# Altium schematic sheet ZHSD-BOOT-STORAGE.SchDoc
size A3
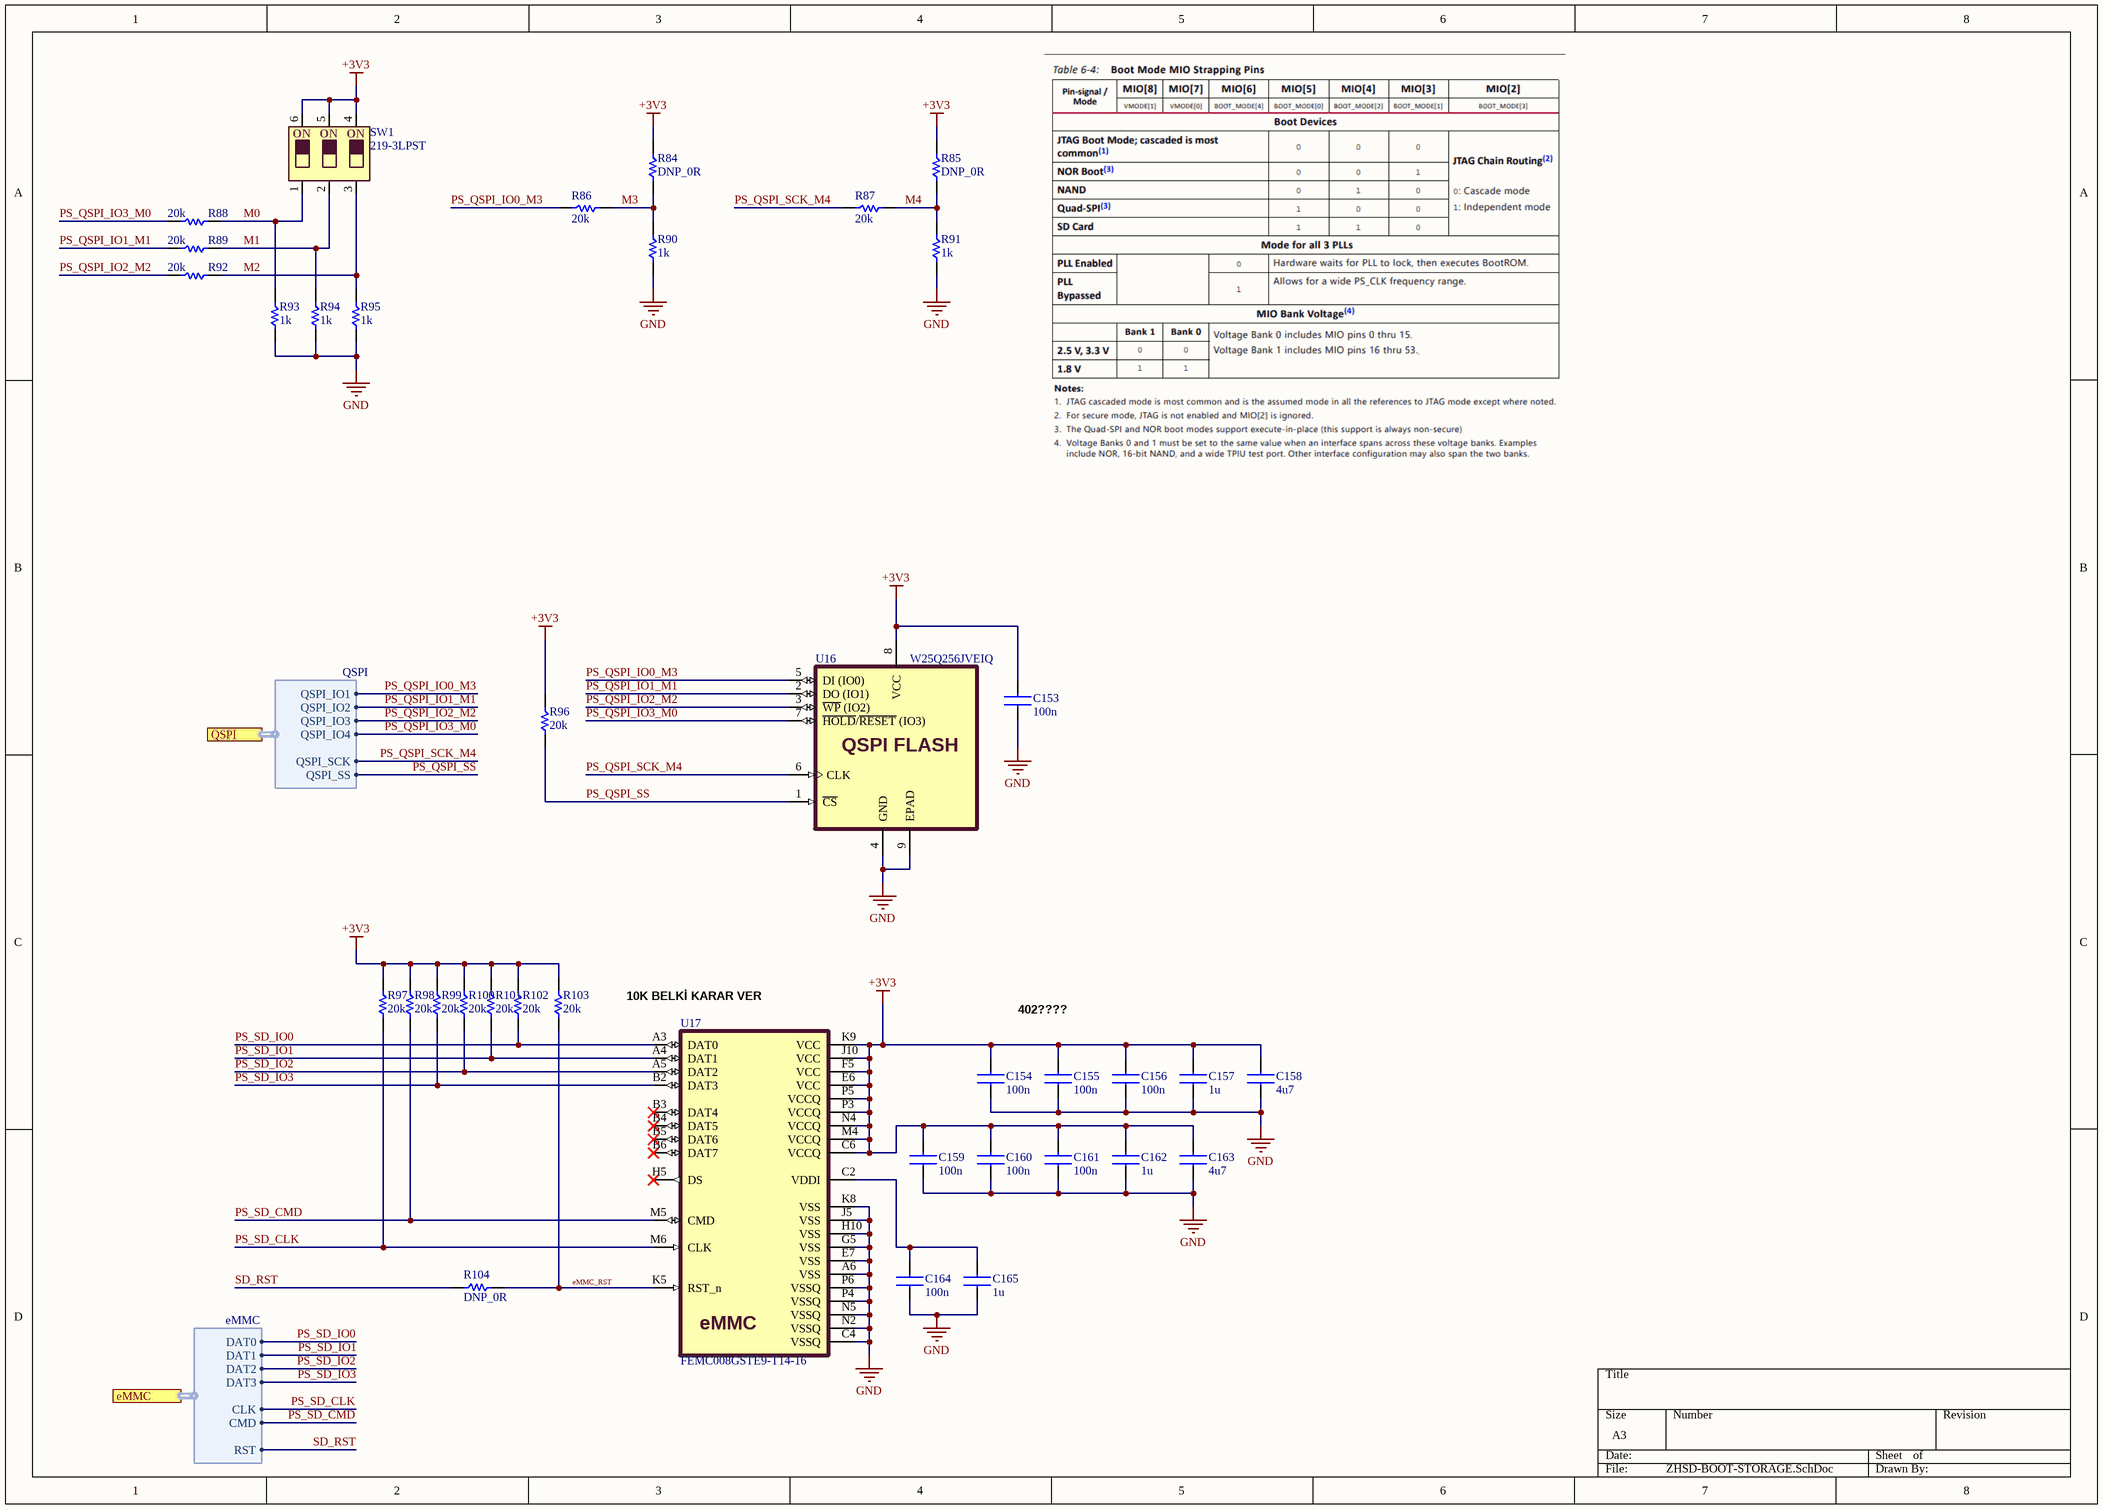
[diagram p0: ZHSD-BOOT-STORAGE.SchDoc]

## Parts
C153  100n  [0603CAPC1608X09N]
C154  100n  [0603CAPC1608X09N]
C155  100n  [0603CAPC1608X09N]
C156  100n  [0603CAPC1608X09N]
C157  1u  [0603CAPC1608X09N]
C158  4u7  [0603CAPC1608X09N]
C159  100n  [0603CAPC1608X09N]
C160  100n  [0603CAPC1608X09N]
C161  100n  [0603CAPC1608X09N]
C162  1u  [0603CAPC1608X09N]
C163  4u7  [0603CAPC1608X09N]
C164  100n  [0603CAPC1608X09N]
C165  1u  [0603CAPC1608X09N]
R84  DNP_0R  [0402RESC1005X04N]
R85  DNP_0R  [0402RESC1005X04N]
R86  20k  [0402RESC1005X04N]
R87  20k  [0402RESC1005X04N]
R88  20k  [0402RESC1005X04N]
R89  20k  [0402RESC1005X04N]
R90  1k  [0402RESC1005X04N]
R91  1k  [0402RESC1005X04N]
R92  20k  [0402RESC1005X04N]
R93  1k  [0402RESC1005X04N]
R94  1k  [0402RESC1005X04N]
R95  1k  [0402RESC1005X04N]
R96  20k  [0402RESC1005X04N]
R97  20k  [0402RESC1005X04N]
R98  20k  [0402RESC1005X04N]
R99  20k  [0402RESC1005X04N]
R100  20k  [0402RESC1005X04N]
R101  20k  [0402RESC1005X04N]
R102  20k  [0402RESC1005X04N]
R103  20k  [0402RESC1005X04N]
R104  DNP_0R  [0402RESC1005X04N]
SW1  219-3LPST  [219-3LPST]
U16  W25Q256JVEIQ  [WSON8X6-SON127P800X80_HS-9N]
U17  FEMC008GSTE9-T14-16  [BGA153C50P14X14_1150X1300X100]

## Ports
eMMC (harness eMMC, see ZHSD-Block[3C], ZHSD-ZYNQ-MIO[4C]), QSPI (harness QSPI, see ZHSD-Block[3C], ZHSD-ZYNQ-MIO[4C])

## Harnesses
eMMC: DAT0, DAT1, DAT2, DAT3, CLK, CMD, RST
QSPI: QSPI_IO1, QSPI_IO2, QSPI_IO3, QSPI_IO4, QSPI_SCK, QSPI_SS

## Nets
+3V3: C153.2 C154.2 C155.2 C156.2 C157.2 C158.2 C159.2 C160.2 C161.2 C162.2 C163.2 R84.2 R85.2 R96.2 R97.2 R98.2 R99.2 R100.2 R101.2 R102.2 R103.2 SW1.4 SW1.5 SW1.6 U16.8(VCC) U17.C6(VCCQ) U17.E6(VCC) U17.F5(VCC) U17.J10(VCC) U17.K9(VCC) U17.M4(VCCQ) U17.N4(VCCQ) U17.P3(VCCQ) U17.P5(VCCQ)
GND: C153.1 C154.1 C155.1 C156.1 C157.1 C158.1 C159.1 C160.1 C161.1 C162.1 C163.1 C164.1 C165.1 R90.1 R91.1 R93.1 R94.1 R95.1 U16.4(GND) U16.9(EPAD) U17.A6(VSS) U17.C4(VSSQ) U17.E7(VSS) U17.G5(VSS) U17.H10(VSS) U17.J5(VSS) U17.K8(VSS) U17.N2(VSSQ) U17.N5(VSSQ) U17.P4(VSSQ) U17.P6(VSSQ)
eMMC_RST: R103.1 R104.2 U17.K5(RST_n)
M0: R88.1 R93.2 SW1.1
M1: R89.1 R94.2 SW1.2
M2: R92.1 R95.2 SW1.3
M3: R84.1 R86.1 R90.2
M4: R85.1 R87.1 R91.2
PS_QSPI_IO0_M3: R86.2 U16.5(DI_(IO0)) ; port QSPI.QSPI_IO1
PS_QSPI_IO1_M1: R89.2 U16.2(DO_(IO1)) ; port QSPI.QSPI_IO2
PS_QSPI_IO2_M2: R92.2 U16.3(~{WP}_(IO2)) ; port QSPI.QSPI_IO3
PS_QSPI_IO3_M0: R88.2 U16.7(~{HOLD}/~{RESET}_(IO3)) ; port QSPI.QSPI_IO4
PS_QSPI_SCK_M4: R87.2 U16.6(CLK) ; port QSPI.QSPI_SCK
PS_QSPI_SS: R96.1 U16.1(~{CS}) ; port QSPI.QSPI_SS
PS_SD_CLK: R97.1 U17.M6(CLK) ; port eMMC.CLK
PS_SD_CMD: R98.1 U17.M5(CMD) ; port eMMC.CMD
PS_SD_IO0: R102.1 U17.A3(DAT0) ; port eMMC.DAT0
PS_SD_IO1: R101.1 U17.A4(DAT1) ; port eMMC.DAT1
PS_SD_IO2: R100.1 U17.A5(DAT2) ; port eMMC.DAT2
PS_SD_IO3: R99.1 U17.B2(DAT3) ; port eMMC.DAT3
SD_RST: R104.1 ; port eMMC.RST
NetC164_2: C164.2 C165.2 U17.C2(VDDI)

Not connected (* = marked no-connect by the designer): U17 B3(DAT4)* B4(DAT5)* B5(DAT6)* B6(DAT7)* H5(DS)*

## Notes on the sheet
- (near U17) 10K BELKİ KARAR VER
- 402????
- (in symbol 219-3LPST) ON
- (in symbol FEMC008GSTE9-T14-16) eMMC
- (in symbol W25Q256JVEIQ) QSPI FLASH

## Library data of the parts
C153-C156 C159-C161 C164 = GRM155R71C104KA88J: CAP CER 0.1UF 16V X7R 0402 (1005) ±10%; Manufacturer: Murata Electronics; Value: 0.1 µF; ComponentLink1Description: Datasheet; ComponentLink1URL: https://search.murata.co.jp/Ceramy/image/img/A01X/G101/ENG/GRM155R71C104KA88-01.pdf; MPN: GRM155R71C104KA88J; Package: 0402; Tolerance: ±10%; Voltage: 16V
C157 C162 C165 = GRM188R61E105KA12D: CAP CER 1UF 25V X5R 0603 (1608) ±10%; Manufacturer: Murata Power Solutions Inc.; Value: 1 µF; ComponentLink1Description: Datasheet; ComponentLink1URL: https://search.murata.co.jp/Ceramy/image/img/A01X/G101/ENG/GRM188R61E105KA12-01.pdf; MPN: GRM188R61E105KA12D; Package: 0603; Tolerance: ±10%; Voltage: 25V
C158 C163 = CL10A475KP8NNNC: CAP CER 4.7UF 10V X5R 0603 (1608) ±10%; Manufacturer: Samsung Electro-Mechanics; Value: 4.7 µF; ComponentLink1Description: Datasheet; ComponentLink1URL: https://mm.digikey.com/Volume0/opasdata/d220001/medias/docus/609/CL10A475KP8NNNC_Spec.pdf; MPN: CL10A475KP8NNNC; Package: 0603; Tolerance: ±10%; Voltage: 10V
R84 R85 R104 = DNP_RES: DO NOT POPULATE RESISTOR; Manufacturer: ***; Value: ***; ComponentLink1Description: Datasheet; ComponentLink1URL: https://yageogroup.com/content/datasheet/asset/file/PYU-RT_1-TO-0-01_ROHS_L; MPN: ***; Voltage: ***; Tolerance: ***; Package: 0402
R86-R89 R92 R96-R103 = RC0402FR-0720KL: RES 20K OHM 1% 1/16W 0402 (1005); Manufacturer: YAGEO; Value: 20 kOhms; Voltage: 50V; ComponentLink1Description: Datasheet; ComponentLink1URL: https://yageogroup.com/content/datasheet/asset/file/PYU-RT_1-TO-0-01_ROHS_L; MPN: RC0402FR-0720KL; Tolerance: ±1%; Package: 0402
R90 R91 R93-R95 = RC0402JR-071KL: RES 1K OHM 5% 1/16W 0402 (1005); Manufacturer: YAGEO; Value: 1 kOhms; Voltage: 50V; ComponentLink1Description: Datasheet; ComponentLink1URL: https://yageogroup.com/content/datasheet/asset/file/PYU-RT_1-TO-0-01_ROHS_L; MPN: RC0402JR-071KL; Tolerance: ±5%; Package: 0402
SW1 = 219-3LPST: Dip Switch SPST 3 Position Surface Mount Slide (Standard) Actuator 100mA 20VDC; Manufacturer: CTS Electrocomponents; Manufacturer Part Number: 219-3LPST; ComponentLink1Description: Datasheet; ComponentLink1URL: https://www.ctscorp.com/Files/DataSheets/Switches/DIP-Switches/CTS-Switches-DIP-219-Series-Datasheet.pdf
U16 = W25Q256JVEIQ: FLASH - NOR Memory IC 256Mbit SPI - Quad I/O 133 MHz 8-WSON (8x6); Manufacturer: Winbond Electronics; ComponentLink1Description: Datasheet; ComponentLink1URL: https://www.winbond.com/resource-files/w25q256jv%20spi%20revg%2008032017.pdf; MPN: W25Q256JVEIQ
U17 = FEMC008GSTE9-T14-16: FLASH - NAND (MLC) Memory IC 64Gbit eMMC_5.1 200 MHz 153-FBGA (11.5x13); Manufacturer: Flexxon Pte Ltd; ComponentLink1Description: Datasheet; ComponentLink1URL: https://mm.digikey.com/Volume0/opasdata/d220001/medias/docus/6348/FLEXXON%20eMMC%205.1%20MLC%20%28XTRA%20III%20153ball%29%20SPEC%20V1.9.pdf; MPN: FEMC008GSTE9-T14-16